# EAGLE schematic Cing_MainBoard (EAGLE 9.1.0)

## Sheet 1 of 5: Cing procesor socket schematic
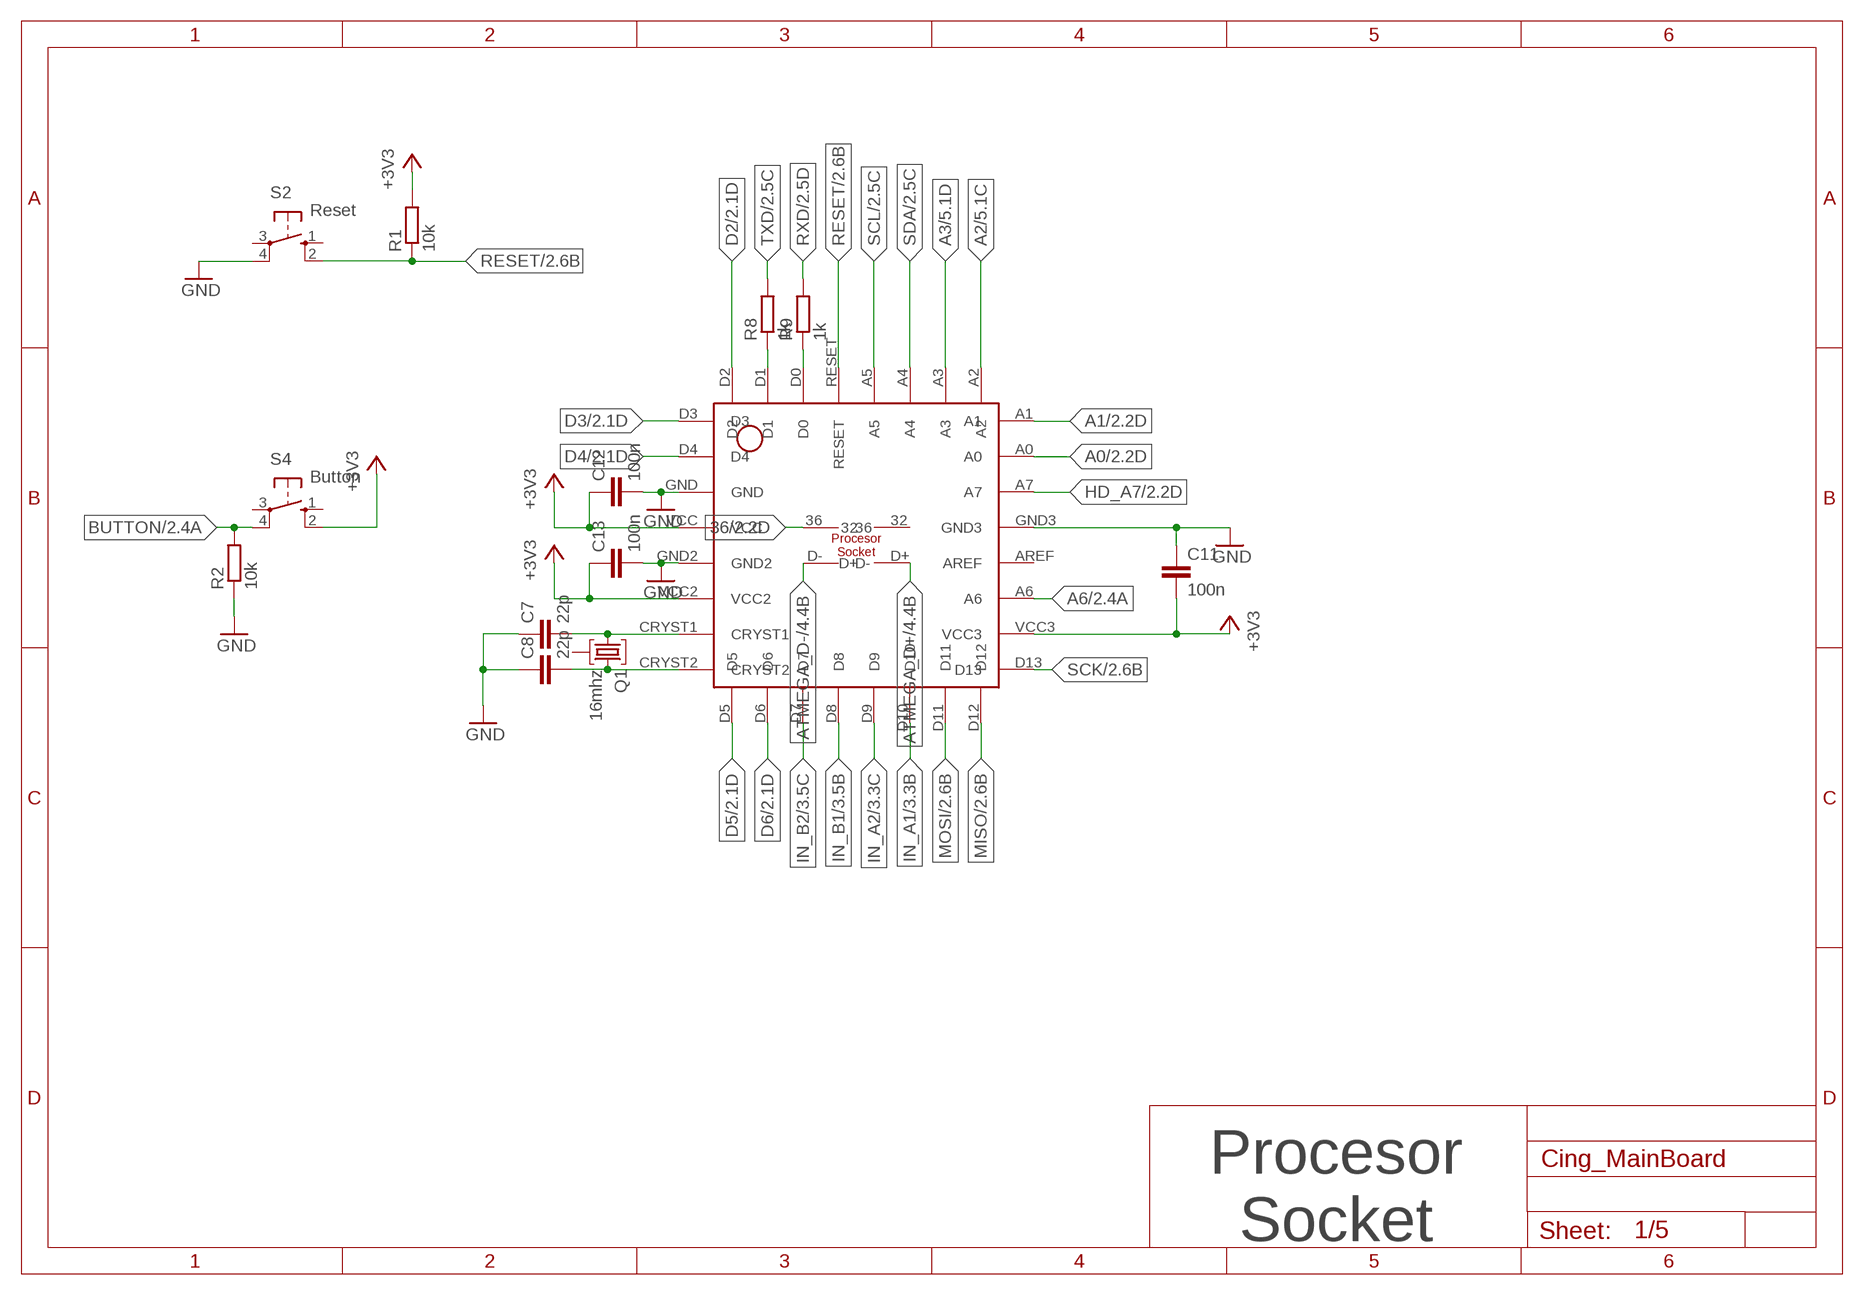
[diagram p0: schematic, sheet 1]

### Parts
C7  22p  C-EUC1206  [C1206]
C8  22p  C-EUC1206  [C1206]
C11  100n  C-EUC1206  [C1206]
C12  100n  C-EUC1206  [C1206]
C13  100n  C-EUC1206  [C1206]
Q1  16mhz  12M10AHC49HT  [HC49U]
R1  10k  R-EU_R1206  [R1206]
R2  10k  R-EU_R1206  [R1206]
R8  1k  R-EU_R1206  [R1206]
R9  1k  R-EU_R1206  [R1206]
S2  Reset  10-XX  [B3F-10XX]
S4  Button  10-XX  [B3F-10XX]
U$1  PROCESSOR-SOCKET_PCB  [PROCESSOR-SOCKET_PCB]

### Nets
36: U$1.36 ; also sheet 2
+3V3: C11.2 C12.1 C13.1 R1.2 S4.2(S1) U$1.VCC U$1.VCC2 U$1.VCC3 ; also sheet 2,3,4,5
A0: U$1.A0 ; also sheet 2
A1: U$1.A1 ; also sheet 2
A2: U$1.A2 ; also sheet 5
A3: U$1.A3 ; also sheet 5
A6: U$1.A6 ; also sheet 2
ATMEGA_D+: U$1.D+ ; also sheet 4
ATMEGA_D-: U$1.D- ; also sheet 4
BUTTON: R2.2 S4.4(P1) ; also sheet 2
D2: U$1.D2 ; also sheet 2
D3: U$1.D3 ; also sheet 2
D4: U$1.D4 ; also sheet 2
D5: U$1.D5 ; also sheet 2
D6: U$1.D6 ; also sheet 2
GND: C7.1 C8.1 C11.1 C12.2 C13.2 R2.1 S2.4(P1) U$1.GND U$1.GND2 U$1.GND3 ; also sheet 2,3,4,5
HD_A7: U$1.A7 ; also sheet 2
IN_A1: U$1.D10 ; also sheet 3
IN_A2: U$1.D9 ; also sheet 3
IN_B1: U$1.D8 ; also sheet 3
IN_B2: U$1.D7 ; also sheet 3
MISO: U$1.D12 ; also sheet 2,3
MOSI: U$1.D11 ; also sheet 2,3
N$3: R8.1 U$1.D1
N$6: R9.1 U$1.D0
N$7: C8.2 Q1.3 U$1.CRYST2
N$14: C7.2 Q1.1 U$1.CRYST1
RESET: R1.1 S2.2(S1) U$1.RESET ; also sheet 2,5
RXD: R9.2 ; also sheet 2,5
SCK: U$1.D13 ; also sheet 2,5
SCL: U$1.A5 ; also sheet 2,5
SDA: U$1.A4 ; also sheet 2,5
TXD: R8.2 ; also sheet 2,5
Unconnected: Q1.2 S2.1(S) S2.3(P) S4.1(S) S4.3(P) U$1.32 U$1.AREF

### Notes on the sheet
- Procesor
  Socket

## Sheet 2 of 5: Connectors
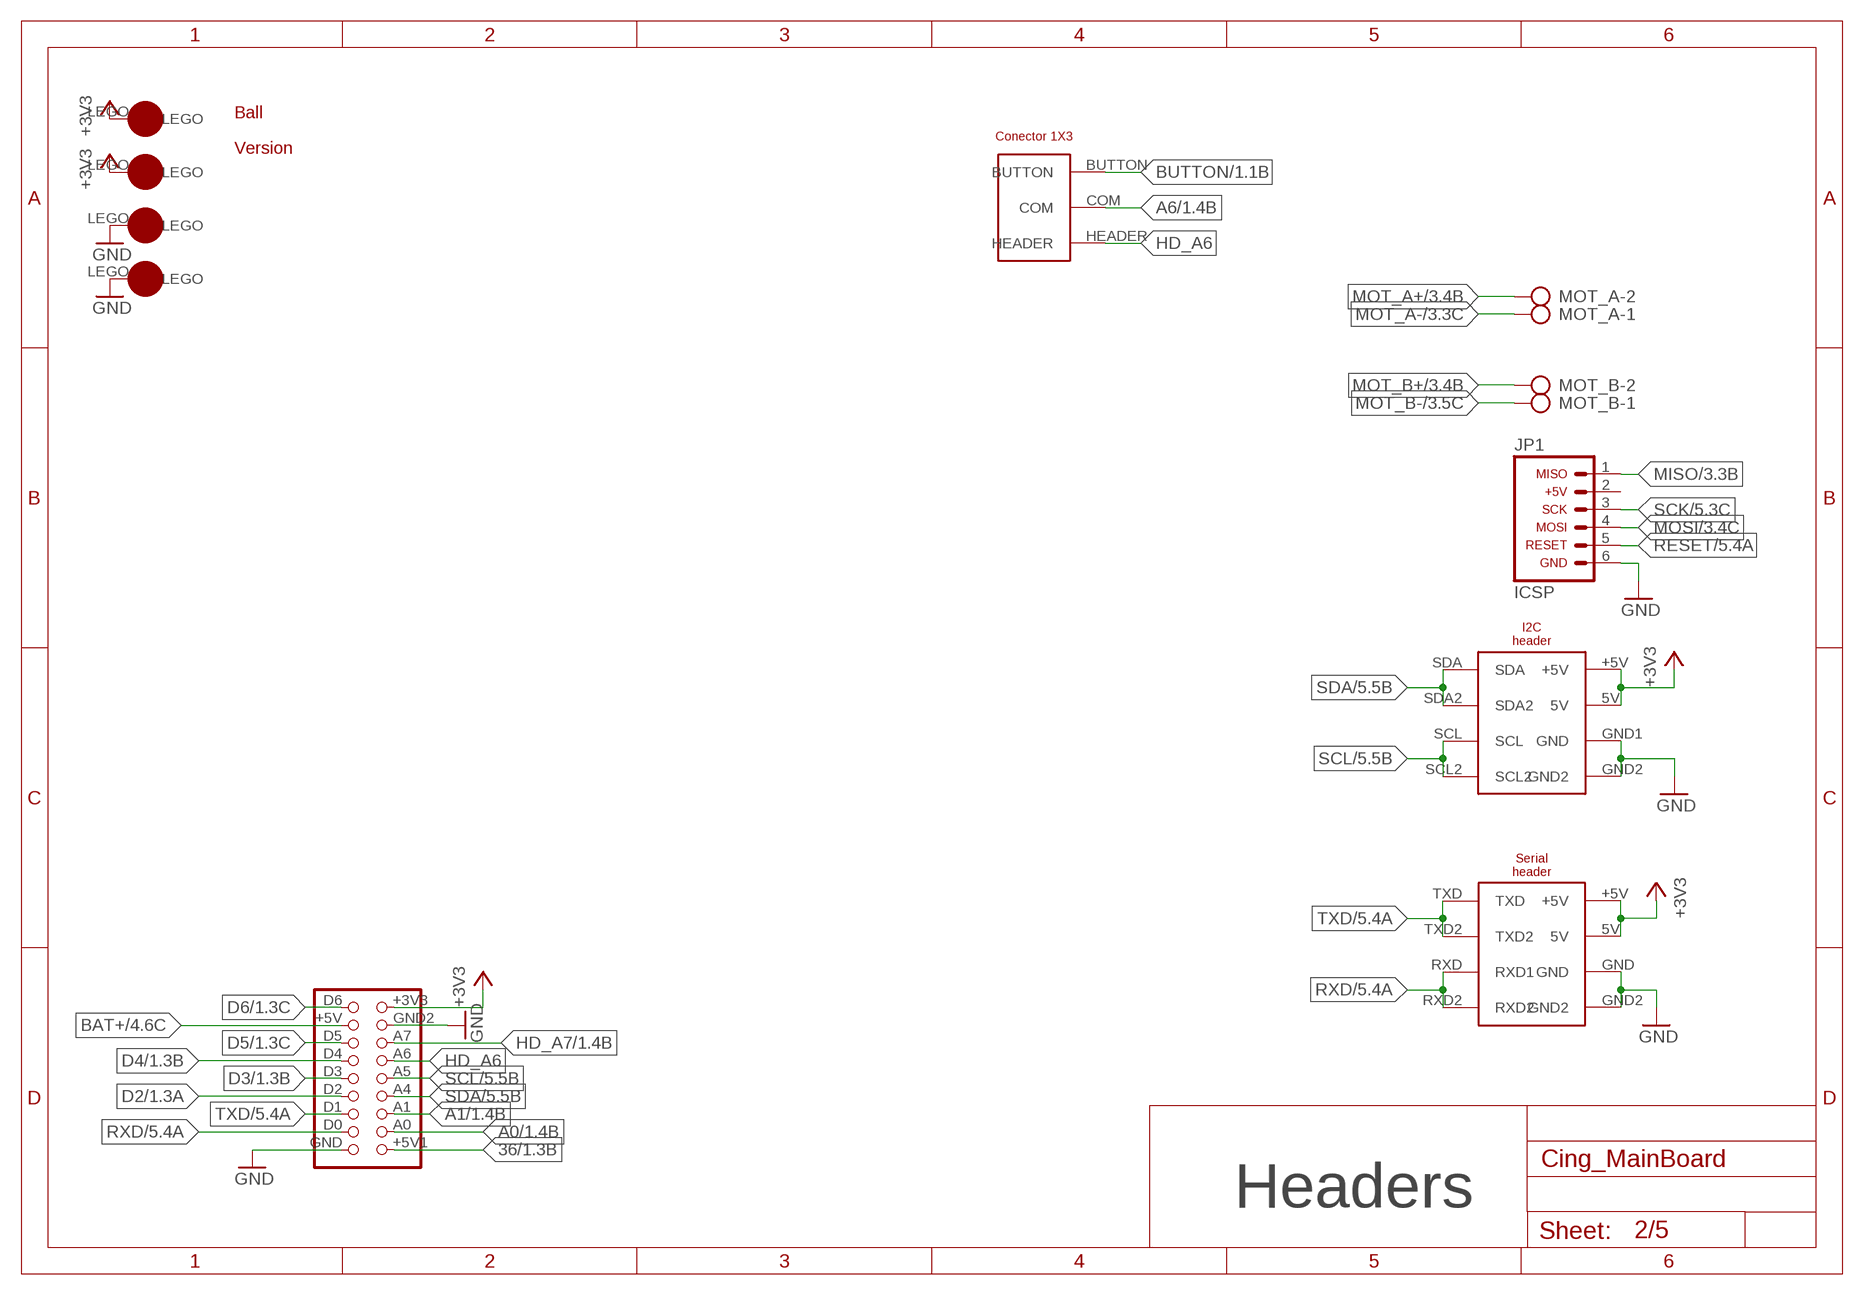
[diagram p1: schematic, sheet 2]

### Parts
JP1  ICSP  ICSP_HEADER  [ICSP_HEADER]
MOT_A  AK500/2  [AK500/2]
MOT_B  AK500/2  [AK500/2]
U$2  BIG_HEADER  [BIG_HEADER]
U$3  I2C_HEADER  [I2_HEADER]
U$4  SERIAL_HEADER  [SERIAL_HEADER]
U$15  CONNECTOR_BUTTON  [CONNECTOR_BUTTON]
U$16  3.3V  LEGO-1X1  [LEGO-1X1]
U$17  3.3V  LEGO-1X1  [LEGO-1X1]
U$18  GND  LEGO-1X1  [LEGO-1X1]
U$19  GND  LEGO-1X1  [LEGO-1X1]
U$20  BALL  [BALL]
VERSION  2.0  VERSION  [VERSION]

### Nets
36: U$2.+5V1 ; also sheet 1
+3V3: U$2.+3V3 U$3.5V U$3.+5V U$4.5V U$4.+5V U$16.LEGO U$17.LEGO ; also sheet 1,3,4,5
A0: U$2.A0 ; also sheet 1
A1: U$2.A1 ; also sheet 1
A6: U$15.COM ; also sheet 1
BAT+: U$2.+5V ; also sheet 4
BUTTON: U$15.BUTTON ; also sheet 1
D2: U$2.D2 ; also sheet 1
D3: U$2.D3 ; also sheet 1
D4: U$2.D4 ; also sheet 1
D5: U$2.D5 ; also sheet 1
D6: U$2.D6 ; also sheet 1
GND: JP1.6 U$2.GND U$2.GND2(GND1) U$3.GND1(GND) U$3.GND2 U$4.GND U$4.GND2 U$18.LEGO U$19.LEGO ; also sheet 1,3,4,5
HD_A6: U$2.A6 U$15.HEADER
HD_A7: U$2.A7 ; also sheet 1
MISO: JP1.1 ; also sheet 1,3
MOSI: JP1.4 ; also sheet 1,3
MOT_A+: MOT_A.2 ; also sheet 3
MOT_A-: MOT_A.1 ; also sheet 3
MOT_B+: MOT_B.2 ; also sheet 3
MOT_B-: MOT_B.1 ; also sheet 3
RESET: JP1.5 ; also sheet 1,5
RXD: U$2.D0 U$4.RXD2 U$4.RXD(RXD1) ; also sheet 1,5
SCK: JP1.3 ; also sheet 1,5
SCL: U$2.A5 U$3.SCL U$3.SCL2 ; also sheet 1,5
SDA: U$2.A4 U$3.SDA U$3.SDA2 ; also sheet 1,5
TXD: U$2.D1 U$4.TXD U$4.TXD2 ; also sheet 1,5
Unconnected: JP1.2

### Notes on the sheet
- Headers

## Sheet 3 of 5: Motor driver schematic
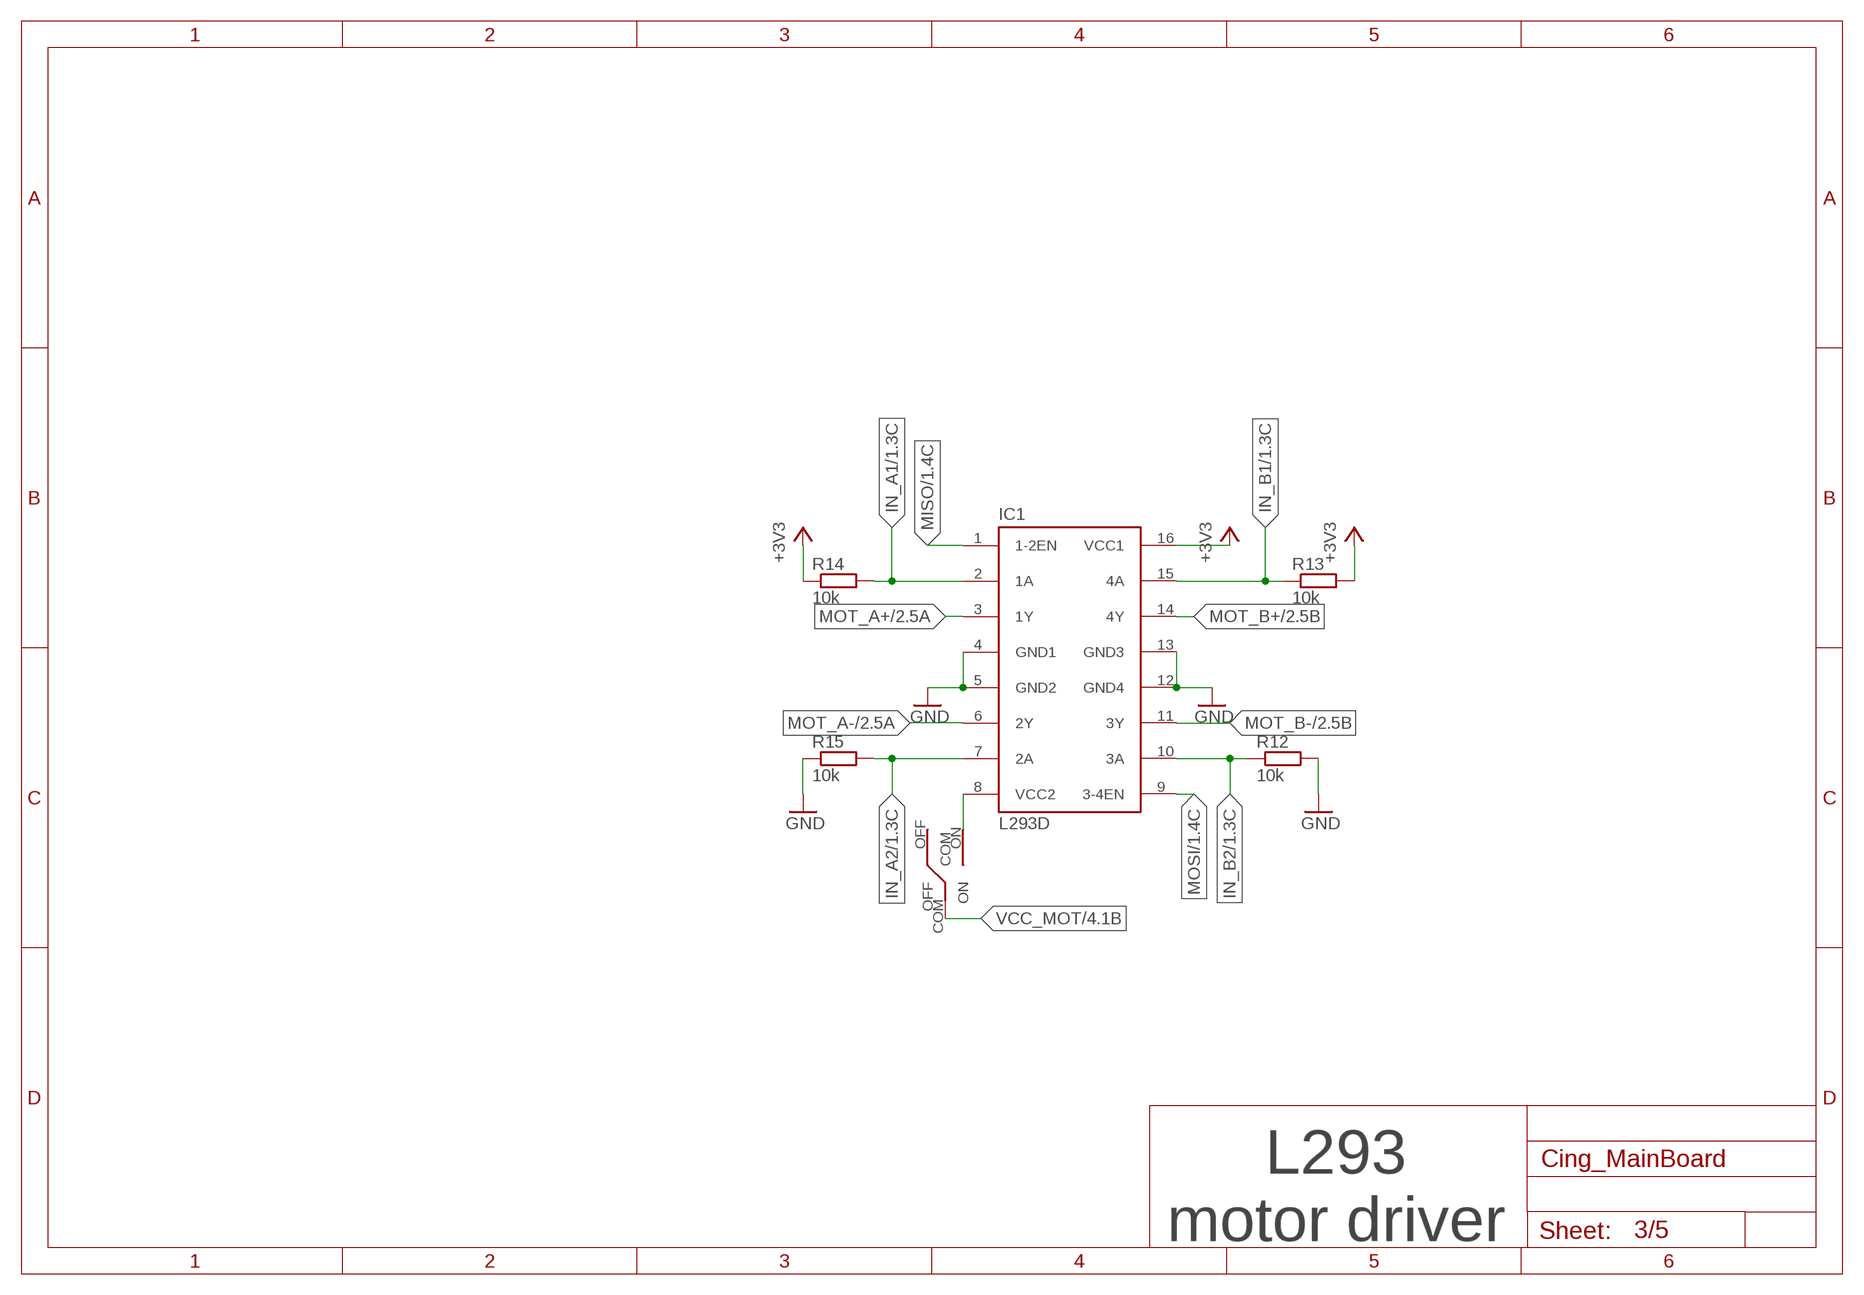
[diagram p2: schematic, sheet 3]

### Parts
IC1  L293D  [L293]
R12  10k  R-EU_R1206  [R1206]
R13  10k  R-EU_R1206  [R1206]
R14  10k  R-EU_R1206  [R1206]
R15  10k  R-EU_R1206  [R1206]
U$5  SWITCH  [SWITCH]

### Nets
+3V3: IC1.16(VCC1) R13.2 R14.1 ; also sheet 1,2,4,5
GND: IC1.4(GND1) IC1.5(GND2) IC1.12(GND4) IC1.13(GND3) R12.2 R15.1 ; also sheet 1,2,4,5
IN_A1: IC1.2(1A) R14.2 ; also sheet 1
IN_A2: IC1.7(2A) R15.2 ; also sheet 1
IN_B1: IC1.15(4A) R13.1 ; also sheet 1
IN_B2: IC1.10(3A) R12.1 ; also sheet 1
MISO: IC1.1(1-2EN) ; also sheet 1,2
MOSI: IC1.9(3-4EN) ; also sheet 1,2
MOT_A+: IC1.3(1Y) ; also sheet 2
MOT_A-: IC1.6(2Y) ; also sheet 2
MOT_B+: IC1.14(4Y) ; also sheet 2
MOT_B-: IC1.11(3Y) ; also sheet 2
N$4: IC1.8(VCC2) U$5.ON
VCC_MOT: U$5.COM ; also sheet 4
Unconnected: U$5.OFF

### Notes on the sheet
- L293
  motor driver

## Sheet 4 of 5: Power circuits
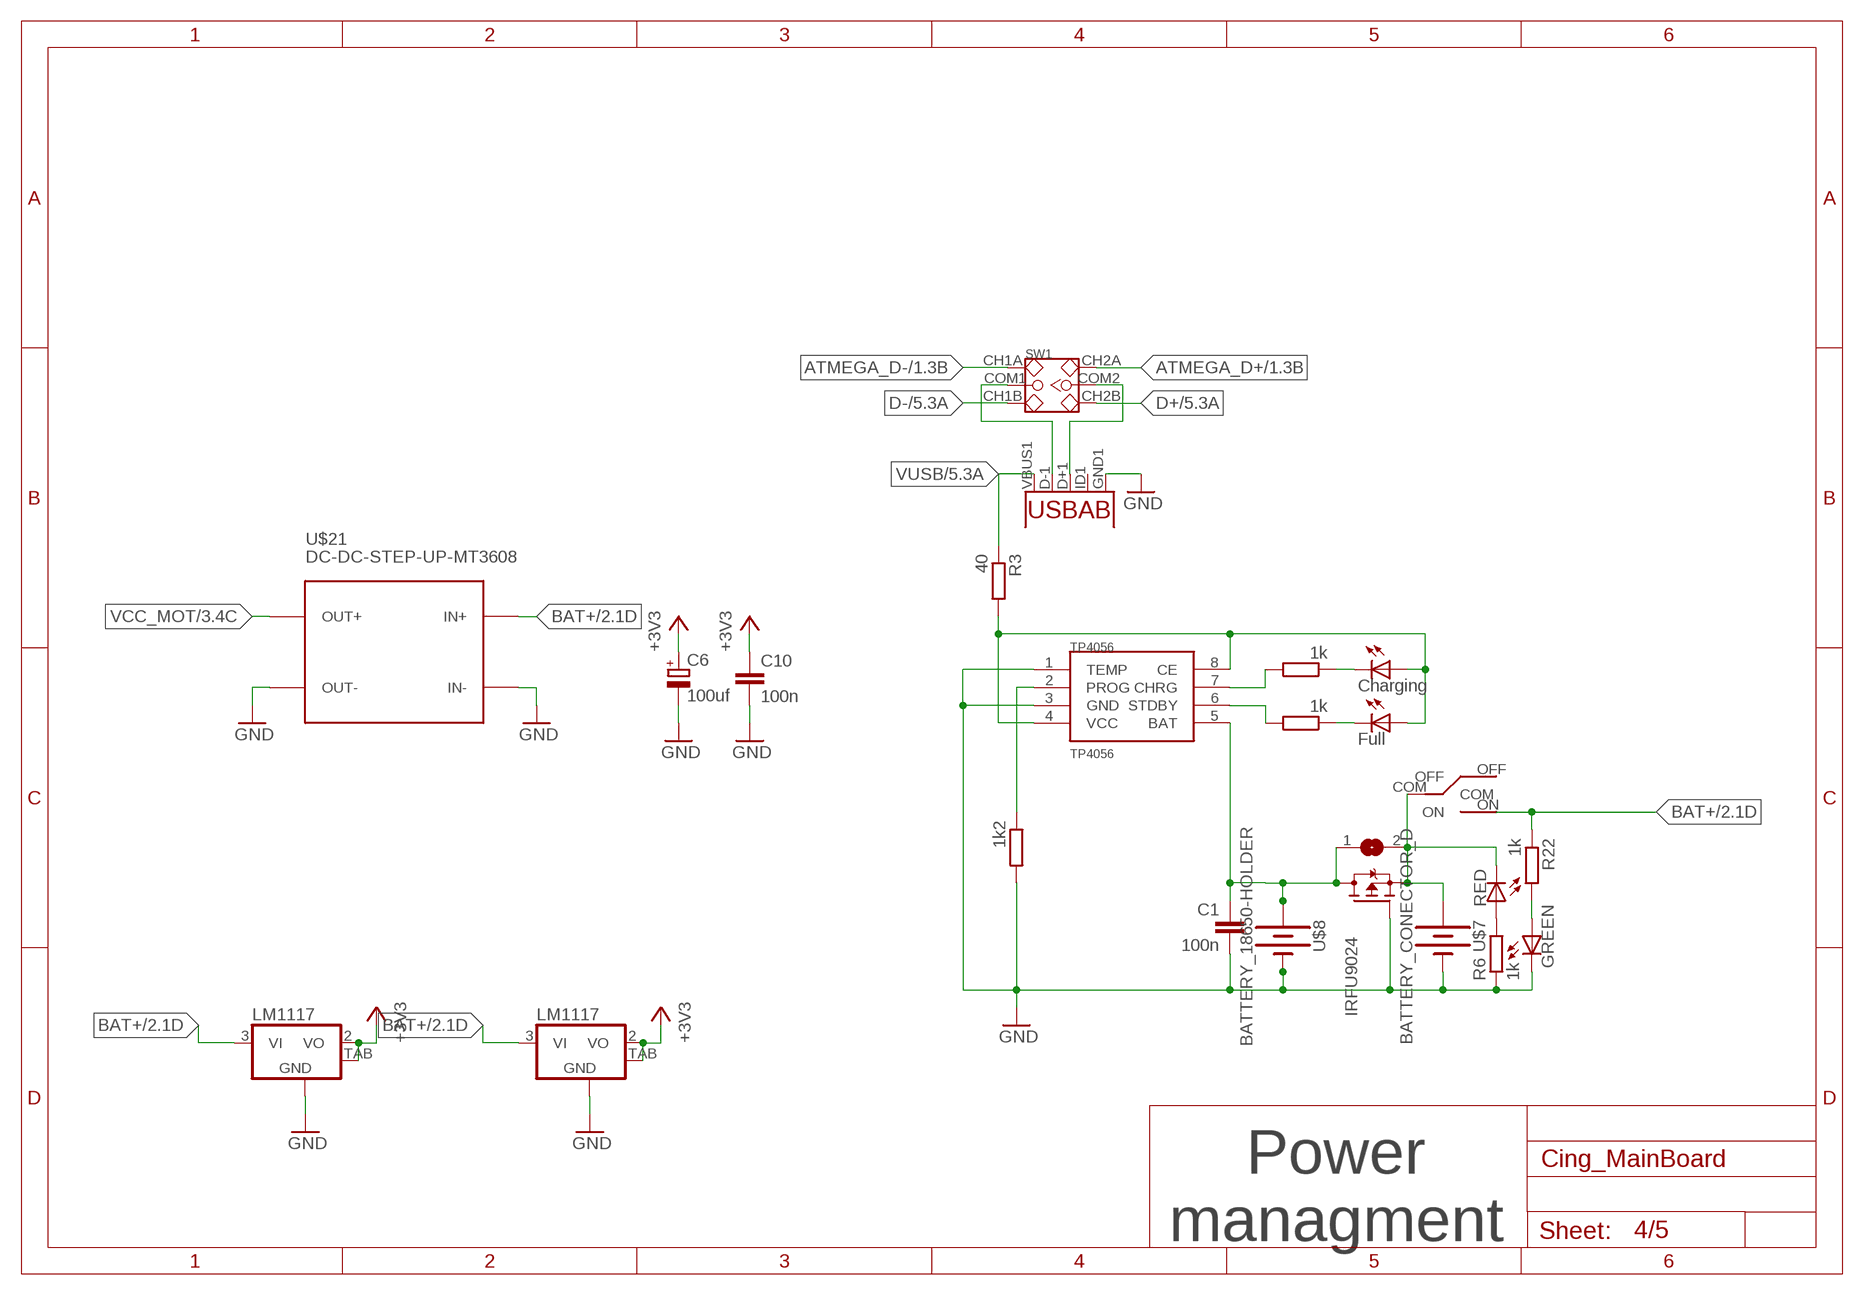
[diagram p3: schematic, sheet 4]

### Parts
C1  100n  C-EUC1206  [C1206]
C6  100uf  CPOL-EUE3.5-8  [E3,5-8]
C10  100n  C-EUC1206  [C1206]
IRFU9024  IRFU9024  [IRFU9024]
LED1  Charging  LEDSMT1206  [1206]
ON  GREEN  LEDSMT1206  [1206]
R3  40  R-EU_R1206  [R1206]
R4  1k2  R-EU_R1206  [R1206]
R5  1k  R-EU_R1206  [R1206]
R6  1k  R-EU_R1206  [R1206]
R11  1k  R-EU_R1206  [R1206]
R22  1k  R-EU_R1206  [R1206]
REVERSE  RED  LEDSMT1206  [1206]
SJ1  SJ  [SJ]
SW1  USB_SWITCH  [USB_SWITCH]
TP4056  TP4056  [TP4056]
U1  MICRO_USB""  [USB-MICRO-SMD]
U$7  BATTERY_CONECTOR_D  [BATTERY_CONECTOR_D]
U$8  BATTERY_18650-HOLDER  [BATTERY_18650-HOLDER]
U$9  SWITCH  [SWITCH]
U$10  LM1117  [LM1117]
U$11  LM1117  [LM1117]
U$21  DC-DC-STEP-UP-MT3608  [DC-DC-STEP-UP-MT3608]
YELLOW  Full  LEDSMT1206  [1206]

### Nets
+3V3: C6.+ C10.1 U$10.2(VO) U$10.TAB(OUT) U$11.2(VO) U$11.TAB(OUT) ; also sheet 1,2,3,5
ATMEGA_D+: SW1.CH2A ; also sheet 1
ATMEGA_D-: SW1.CH1A ; also sheet 1
BAT+: R22.1 U$9.ON U$10.3(VI) U$11.3(VI) U$21.IN+ ; also sheet 2
D+: SW1.CH2B ; also sheet 5
D-: SW1.CH1B ; also sheet 5
GND: C1.2 C6.- C10.2 IRFU9024.G ON.C R4.2 R6.1 TP4056.1(TEMP) TP4056.3(GND) U1.GND1(GND) U$7.- U$8.GND@1(-) U$8.GND@2(-1) U$8.GND@3(-2) U$10.1(GND) U$11.1(GND) U$21.IN- U$21.OUT- ; also sheet 1,2,3,5
IRFU: C1.1 IRFU9024.D SJ1.1 TP4056.5(BAT) U$8.PWR@1(+) U$8.PWR@2(+1) U$8.PWR@3(+2)
N$5: R6.2 REVERSE.A
N$8: SW1.COM1 U1.D-1(D-)
N$9: LED1.C R5.1
N$13: SW1.COM2 U1.D+1(D+)
N$16: R11.1 YELLOW.C
N$18: R11.2 TP4056.6(STDBY)
N$19: R5.2 TP4056.7(CHRG)
N$25: LED1.A R3.2 TP4056.4(VCC) TP4056.8(CE) YELLOW.A
N$27: R4.1 TP4056.2(PROG)
N$28: IRFU9024.S REVERSE.C SJ1.2 U$7.+ U$9.COM
N$29: ON.A R22.2
VCC_MOT: U$21.OUT+ ; also sheet 3
VUSB: R3.1 U1.VBUS1(VBUS) ; also sheet 5
Unconnected: U1.ID1(USBID) U$9.OFF

### Notes on the sheet
- Power
  managment

## Sheet 5 of 5: Board sensors and outputs
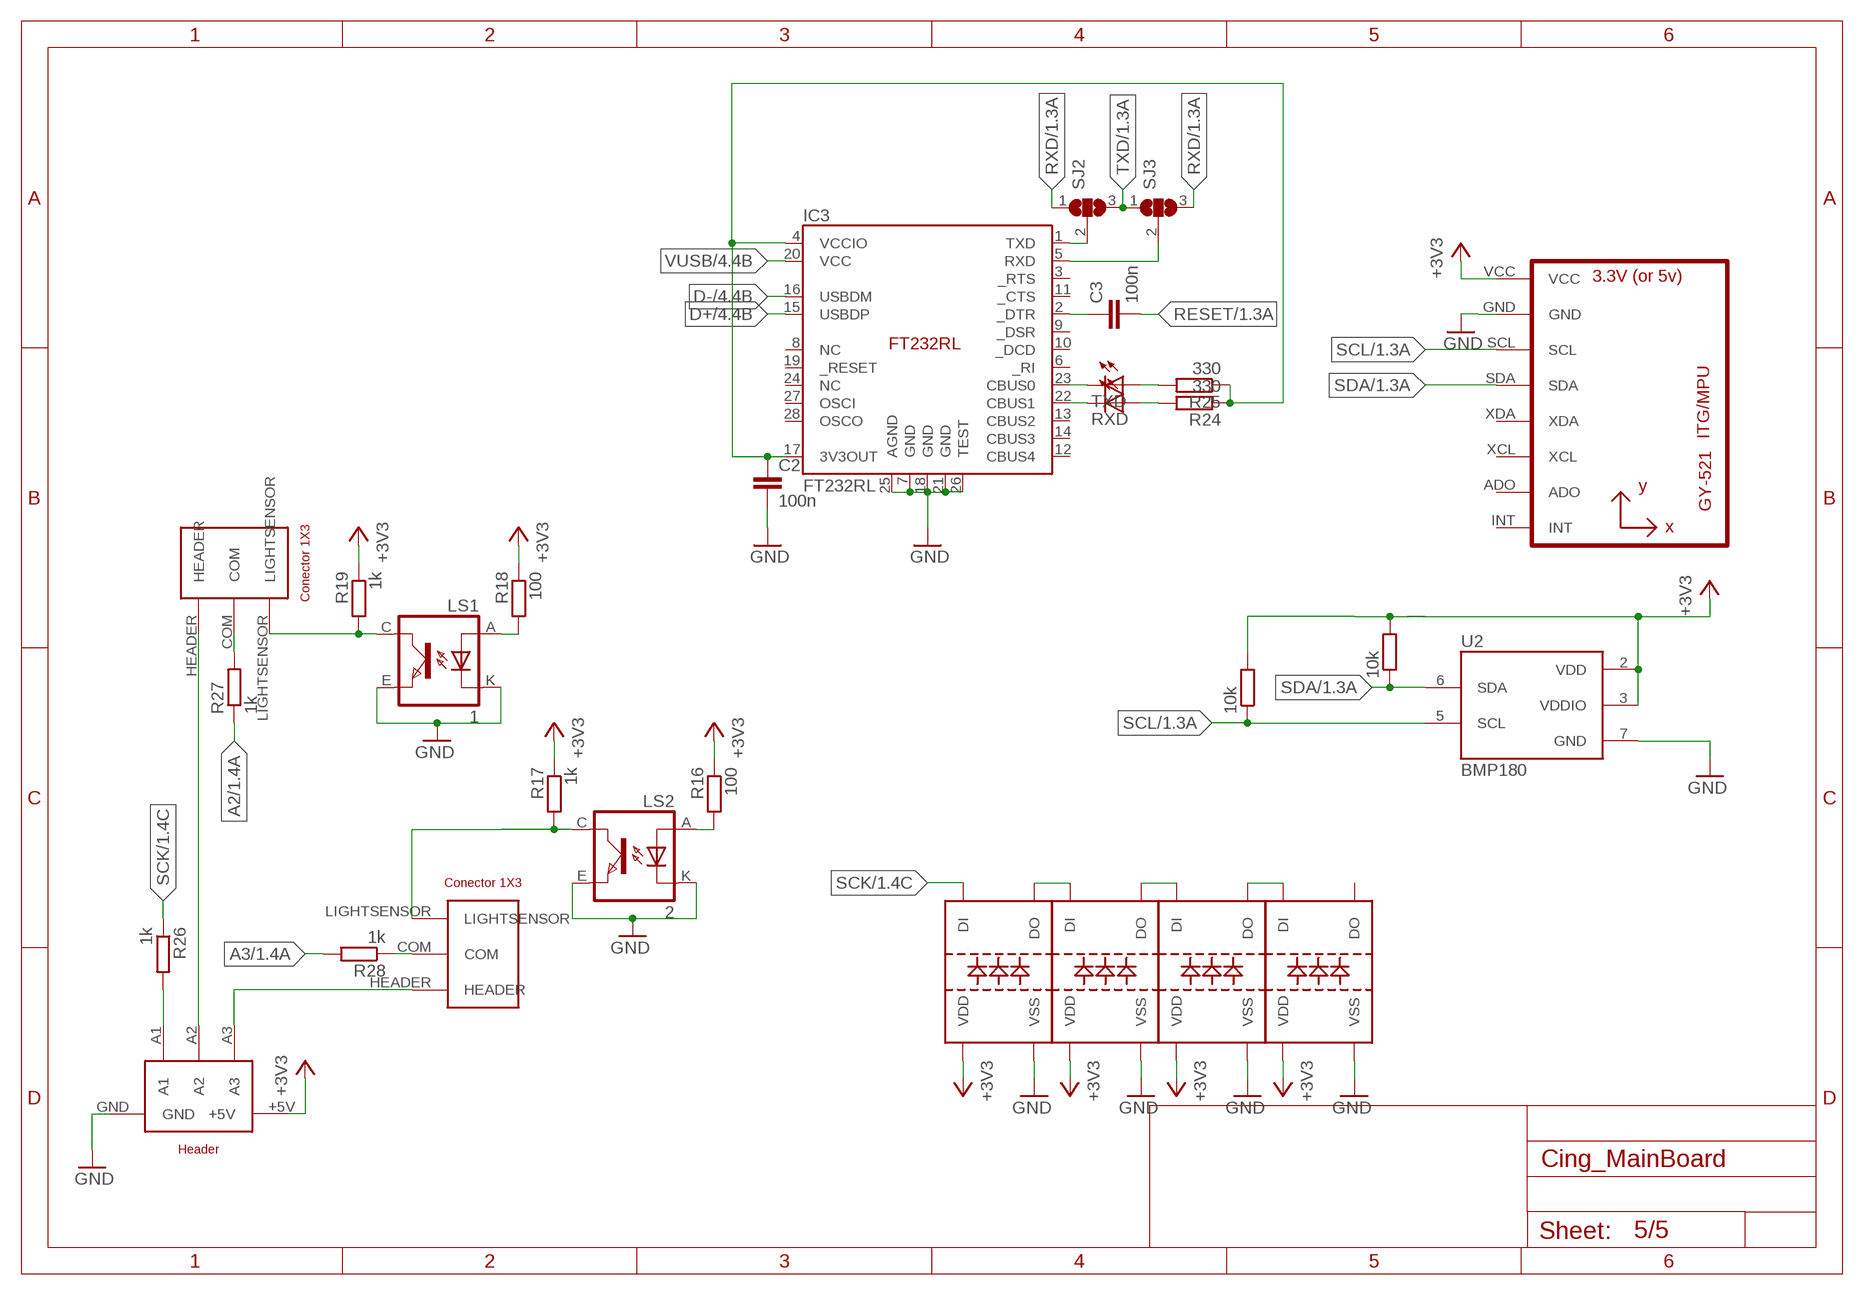
[diagram p4: schematic, sheet 5]

### Parts
C2  100n  C-EUC1206  [C1206]
C3  100n  C-EUC1206  [C1206]
IC3  FT232RL  [FT232RL]
LED3  RXD  LEDSMT1206  [1206]
LED5  WS2812B  [WS2812B]
LED6  WS2812B  [WS2812B]
LED7  WS2812B  [WS2812B]
LED8  WS2812B  [WS2812B]
LS1  1  TCRT5000  [TCRT5000]
LS2  2  TCRT5000  [TCRT5000]
R16  100  R-EU_R1206  [R1206]
R17  1k  R-EU_R1206  [R1206]
R18  100  R-EU_R1206  [R1206]
R19  1k  R-EU_R1206  [R1206]
R24  330  R-EU_R1206  [R1206]
R25  330  R-EU_R1206  [R1206]
R26  1k  R-EU_R1206  [R1206]
R27  1k  R-EU_R1206  [R1206]
R28  1k  R-EU_R1206  [R1206]
R30  10k  R-EU_R1206  [R1206]
R31  10k  R-EU_R1206  [R1206]
SJ2  SJ2W  [SJ_2]
SJ3  SJ2W  [SJ_2]
TXD  TXD  LEDSMT1206  [1206]
U2  BMP180  [BMP180]
U3  MPU-6050MPU6050  [MPU-6050]
U$12  CONNECTOR_1X5  [CONNECTOR_1X5]
U$13  CONNECTOR_LIGHT_SENSOR  [CONNECTOR_LIGHT_SENSOR]
U$14  CONNECTOR_LIGHT_SENSOR  [CONNECTOR_LIGHT_SENSOR]

### Nets
+3V3: LED5.1(VDD) LED6.1(VDD) LED7.1(VDD) LED8.1(VDD) R16.1 R17.1 R18.1 R19.1 R30.2 R31.2 U2.2(VDD) U2.3(VDDIO) U3.VCC U$12.+5V ; also sheet 1,2,3,4
A2: R27.1 ; also sheet 1
A3: R28.2 ; also sheet 1
D+: IC3.15(USBDP) ; also sheet 4
D-: IC3.16(USBDM) ; also sheet 4
GND: C2.2 IC3.7(GND) IC3.18(GND) IC3.21(GND) IC3.25(AGND) IC3.26(TEST) LED5.3(VSS) LED6.3(VSS) LED7.3(VSS) LED8.3(VSS) LS1.E(EMITTER) LS1.K(CATHODE) LS2.E(EMITTER) LS2.K(CATHODE) U2.7(GND) U3.GND U$12.GND ; also sheet 1,2,3,4
N$1: LED5.2(DO) LED6.4(DI)
N$2: LED6.2(DO) LED7.4(DI)
N$10: R28.1 U$14.COM
N$11: LED7.2(DO) LED8.4(DI)
N$20: LS2.A(ANODE) R16.2
N$22: LS1.A(ANODE) R18.2
N$24: LS1.C(COLLECTOR) R19.2 U$13.LIGHTSENSOR
N$31: U$12.A2 U$13.HEADER
N$32: LED3.A R24.2
N$33: IC3.22(CBUS1) LED3.C
N$34: R25.2 TXD.A
N$36: C3.1 IC3.2(_DTR)
N$37: IC3.5(RXD) SJ3.2
N$38: IC3.1(TXD) SJ2.2
N$39: C2.1 IC3.4(VCCIO) IC3.17(3V3OUT) R24.1 R25.1
N$40: U$12.A3 U$14.HEADER
N$42: R26.2 U$12.A1
N$43: R27.2 U$13.COM
N$45: LS2.C(COLLECTOR) R17.2 U$14.LIGHTSENSOR
RESET: C3.2 ; also sheet 1,2
RXD: SJ2.1 SJ3.3 ; also sheet 1,2
SCK: LED5.4(DI) R26.1 ; also sheet 1,2
SCL: R30.1 U2.5(SCL) U3.SCL ; also sheet 1,2
SDA: R31.1 U2.6(SDA) U3.SDA ; also sheet 1,2
T: IC3.23(CBUS0) TXD.C
TXD: SJ2.3 SJ3.1 ; also sheet 1,2
VUSB: IC3.20(VCC) ; also sheet 4
Unconnected: IC3.3(_RTS) IC3.6(_RI) IC3.8(NC) IC3.9(_DSR) IC3.10(_DCD) IC3.11(_CTS) IC3.12(CBUS4) IC3.13(CBUS2) IC3.14(CBUS3) IC3.19(_RESET) IC3.24(NC) IC3.27(OSCI) IC3.28(OSCO) LED8.2(DO) U3.ADO U3.INT U3.XCL U3.XDA

## Library data of the parts
C1-C3 C7 C8 C10-C13 = rcl:C-EU: CAPACITOR, European symbol; SPICEPREFIX: C
C6 = rcl:CPOL-EU: POLARIZED CAPACITOR, European symbol; SPICEPREFIX: C
IC1 = Cing Library:L293D: PUSH-PULL 4 CHANNEL DRIVER; MPN: L293D; OC_FARNELL: 9589619; OC_NEWARK: 56P8249
IC3 = Cing Library:FT232RL
IRFU9024 = Cing Library:IRFU9024
JP1 = Cing Library:ICSP_HEADER: Arduino ICSP I/O Header This is the ICSP I/O header on the Arduino Uno R3. This connector is labeled with the following pin assignments: MISO +5V SCK MOSI RESET GND NOTE: Be sure you install this connector with the correct orientation on your PCB layout. Pin 1 has a square pad to assist with orientation.
LED1 LED3 ON REVERSE TXD YELLOW = led:LED: LED OSRAM: - CHIPLED LG R971, LG N971, LY N971, LG Q971, LY Q971, LO R971, LY R971 LH N974, LH R974 LS Q976, LO Q976, LY Q976 LO Q996 - Hyper CHIPLED LW Q18S LB Q993, LB Q99A, LB R99A - SideLED LS A670, LO A670, LY A670, LG A670, LP A670 LB A673, LV A673, LT A673, LW A673 LH A674 LY A675 LS A676, LA A676, LO A676, LY A676, LW A676 LS A679, LY A679, LG A679 - Hyper Micro SIDELED® LS Y876, LA Y876, LO Y876, LY Y876 LT Y87S - SmartLED LW L88C, LW L88S LB L89C, LB L89S, LG L890 LS L89K, LO L89K, LY L89K LS L896, LA L896, LO L896, LY L896 - TOPLED LS T670, LO T670, LY T670, LG T670, LP T670 LSG T670, LSP T670, LSY T670, LOP T670, LYG T670 LG T671, LOG T671, LSG T671 LB T673, LV T673, LT T673, LW T673 LH T674 LS T676, LA T676, LO T676, LY T676, LB T676, LH T676, LSB T676, LW T676 LB T67C, LV T67C, LT T67C, LS T67K, LO T67K, LY T67K, LW E67C LS E67B, LA E67B, LO E67B, LY E67B, LB E67C, LV E67C, LT E67C LW T67C LS T679, LY T679, LG T679 LS T770, LO T770, LY T770, LG T770, LP T770 LB T773, LV T773, LT T773, LW T773 LH T774 LS E675, LA E675, LY E675, LS T675 LS T776, LA T776, LO T776, LY T776, LB T776 LHGB T686 LT T68C, LB T68C - Hyper Mini TOPLED® LB M676 - Mini TOPLED Santana® LG M470 LS M47K, LO M47K, LY M47K Source: http://www.osram.convergy.de LUXEON: - LUMILED® LXK2-PW12-R00, LXK2-PW12-S00, LXK2-PW14-U00, LXK2-PW14-V00 LXK2-PM12-R00, LXK2-PM12-S00, LXK2-PM14-U00 LXK2-PE12-Q00, LXK2-PE12-R00, LXK2-PE12-S00, LXK2-PE14-T00, LXK2-PE14-U00 LXK2-PB12-K00, LXK2-PB12-L00, LXK2-PB12-M00, LXK2-PB14-N00, LXK2-PB14-P00, LXK2-PB14-Q00 LXK2-PR12-L00, LXK2-PR12-M00, LXK2-PR14-Q00, LXK2-PR14-R00 LXK2-PD12-Q00, LXK2-PD12-R00, LXK2-PD12-S00 LXK2-PH12-R00, LXK2-PH12-S00 LXK2-PL12-P00, LXK2-PL12-Q00, LXK2-PL12-R00 Source: www.luxeon.com KINGBRIGHT: KA-3528ASYC Source: www.kingbright.com
LED5-LED8 = Cing Library:WS2812B
LS1 LS2 = Cing Library:TCRT5000
MOT_A MOT_B = con-ptr500:AK500/2: CONNECTOR; OC_FARNELL: unknown; OC_NEWARK: unknown
Q1 = crystal:12M10AHC49HT: Monolithic Crystal Filters Source: www.vanlong.com; OC_FARNELL: unknown; OC_NEWARK: unknown
R1-R6 R8 R9 R11-R19 R22 R24-R28 R30 R31 = rcl:R-EU_: RESISTOR, European symbol; SPICEPREFIX: R
S2 S4 = switch-omron:10-XX: OMRON SWITCH; MPN: B3F-1000; OC_FARNELL: 176432; OC_NEWARK: 36M3542
SJ1 = jumper:SJ: SMD solder JUMPER
SJ2 SJ3 = jumper:SJ2W: SMD solder JUMPER
SW1 = Cing Library:USB_SWITCH: 311030005
TP4056 = Cing Library:TP4056
U1 = Cing Library:MICRO_USB: This is a USB AB connector that is compatible with USB OTG. i.e. this connector can serve as a host or device
U2 = Cing Library:BMP180: BOSCH BMP180 DIGITAL BAROMETRIC PRESSURE SENSOR Web page: http://www.bosch-sensortec.com/en/homepage/products_3/environmental_sensors_1/bmp180_1/bmp180 Datasheet: http://ae-bst.resource.bosch.com/media/products/dokumente/bmp180/BST-BMP180-DS000-09.pdf The BMP180 is the function compatible successor of the BMP085, a new generation of high precision digital pressure sensors for consumer applications. The ultra-low power, low voltage electronics of the BMP180 is optimized for use in mobile phones, PDAs, GPS navigation devices and outdoor equipment. With a low altitude noise of merely 0.25m at fast conversion time, the BMP180 offers superior performance. The I2C interface allows for easy system integration with a microcontroller. The BMP180 is based on piezo-resistive technology for EMC robustness, high accuracy and linearity as well as long term stability. Key features: - Temperature measurement included - I2C interface - Fully calibrated - Pb-free, halogen-free and RoHS compliant, - MSL 1 Basic specs: Pressure range: 300 to 1100hPa (+9000m to -500m relating to sea level) Supply voltage: 1.8 to 3.6V (VDD), 1.62V to 3.6V (VDDIO) Package: LGA package with metal lid Small footprint: 3.6mm x 3.8mm Super-flat: 0.93mm height Low power: 5µA at 1 sample / sec. in standard mode Low noise: 0.06hPa (0.5m) in ultra low power mode, 0.02hPa (0.17m) advanced resolution mode Typical applications: - Enhancement of GPS navigation (dead-reckoning, slope detection, etc.) - In- and out-door navigation - Leisure and sports - Weather forecast - Vertical velocity indication (rise/sink speed)
U3 = Cing Library:MPU-6050
U$1 = Cing Library:PROCESSOR-SOCKET_PCB
U$2 = Cing Library:BIG_HEADER
U$3 = Cing Library:I2C_HEADER
U$4 = Cing Library:SERIAL_HEADER
U$5 U$9 = Cing Library:SWITCH
U$7 = Cing Library:BATTERY_CONECTOR_D
U$8 = Cing Library:BATTERY_18650-HOLDER
U$10 U$11 = Cing Library:LM1117
U$12 = Cing Library:CONNECTOR_1X5
U$13 U$14 = Cing Library:CONNECTOR_LIGHT_SENSOR
U$15 = Cing Library:CONNECTOR_BUTTON
U$16-U$19 = Cing Library:LEGO-1X1
U$20 = Cing Library:BALL
U$21 = Cing Library:DC-DC-STEP-UP-MT3608: DC/DC Step-Up Regulator based on MT3608 chip MT3608 datasheet available here: https://www.olimex.com/Products/Breadboarding/BB-PWR-3608/resources/MT3608.pdf Click here to find device on ebay.com <http://www.ebay.com/sch/mt3608+module>
VERSION = Cing Library:VERSION